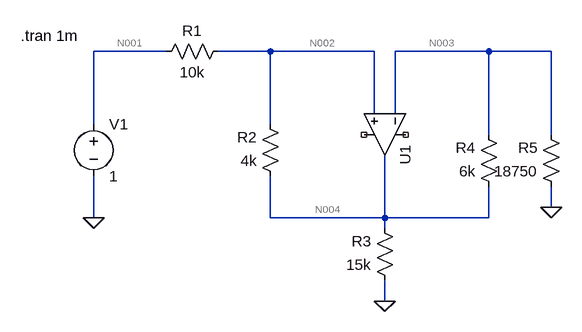
[diagram p0: schematic Q2 at2.asc]
Q2 at2.asc, the LTspice schematic file:
Version 4.1
SHEET 1 880 680
WIRE 48 16 -64 16
WIRE 208 16 128 16
WIRE 368 16 208 16
WIRE 544 16 400 16
WIRE 640 16 544 16
WIRE 368 112 368 16
WIRE 400 112 400 16
WIRE -64 128 -64 16
WIRE 208 128 208 16
WIRE 544 144 544 16
WIRE 640 144 640 16
WIRE 640 256 640 224
WIRE -64 272 -64 208
WIRE 208 272 208 208
WIRE 384 272 384 176
WIRE 384 272 208 272
WIRE 544 272 544 224
WIRE 544 272 384 272
WIRE 384 288 384 272
WIRE 384 400 384 368
FLAG -64 272 0
FLAG 640 256 0
FLAG 384 400 0
SYMBOL voltage -64 112 R0
WINDOW 123 0 0 Left 0
WINDOW 39 0 0 Left 0
SYMATTR InstName V1
SYMATTR Value 1
SYMBOL res 144 0 R90
WINDOW 0 0 56 VBottom 2
WINDOW 3 32 56 VTop 2
SYMATTR InstName R1
SYMATTR Value 10k
SYMBOL res 224 224 R180
WINDOW 0 36 76 Left 2
WINDOW 3 36 40 Left 2
SYMATTR InstName R2
SYMATTR Value 4k
SYMBOL res 400 384 R180
WINDOW 0 36 76 Left 2
WINDOW 3 36 40 Left 2
SYMATTR InstName R3
SYMATTR Value 15k
SYMBOL res 560 240 R180
WINDOW 0 36 76 Left 2
WINDOW 3 36 40 Left 2
SYMATTR InstName R4
SYMATTR Value 6k
SYMBOL res 656 240 R180
WINDOW 0 36 76 Left 2
WINDOW 3 36 40 Left 2
SYMATTR InstName R5
SYMATTR Value 18750
SYMBOL OpAmps\\UniversalOpAmp1 384 144 R90
SYMATTR InstName U1
TEXT -176 -8 Left 2 !.tran 1m

The netlist it stands for:
* Q2 at2.asc
V1 N001 0 1
R1 N002 N001 10k
R2 N004 N002 4k
R3 0 N004 15k
R4 N004 N003 6k
R5 0 N003 18750
X§U1 N002 N003 NC_01 NC_02 N004 level1 Avol=1Meg GBW=10Meg Vos=0 En=0 Enk=0 In=0 Ink=0 Rin=500Meg  ; pins In+ In- V+ V- OUT
.tran 1m
.lib UniversalOpAmp1.lib
.backanno
.end

* Results of the author's LTspice run, read from the files saved beside the schematic
* Operating Point, zero values left out:
*   V(n001) = 1 V
*   V(n002) = 5 V
*   V(n003) = 5 V
*   V(n004) = 6.6 V
*   I(R1) = 400 µA
*   I(R2) = 400 µA
*   I(R3) = -440 µA
*   I(R4) = 266.7 µA
*   I(R5) = -266.7 µA
*   I(V1) = 400 µA
*   Ix(u1:5) = -1.107 mA